# Altium schematic sheet EasyGate1541-II.SchDoc: EasyGate1541-II
size 420 x 297 mm; ApprovedBy: .; CheckedBy: .; Author: DiWou; CompanyName: DL2DW; DrawnBy: DiWou; Engineer: DiWou; Organization: DL2DW; DocumentNumber: 1; Revision: -; SheetNumber: 1; SheetTotal: 1; DrawnDate: 25.01.2021; EngrDate: 25.01.2021; ChkdDate: .; Title1: EasyGate1541-II; Title2: GateArray replacement for Commodore; Title3: 1541-II Disk Drive; Desc1: Version 1.0; Desc2: .; ApprDate: .
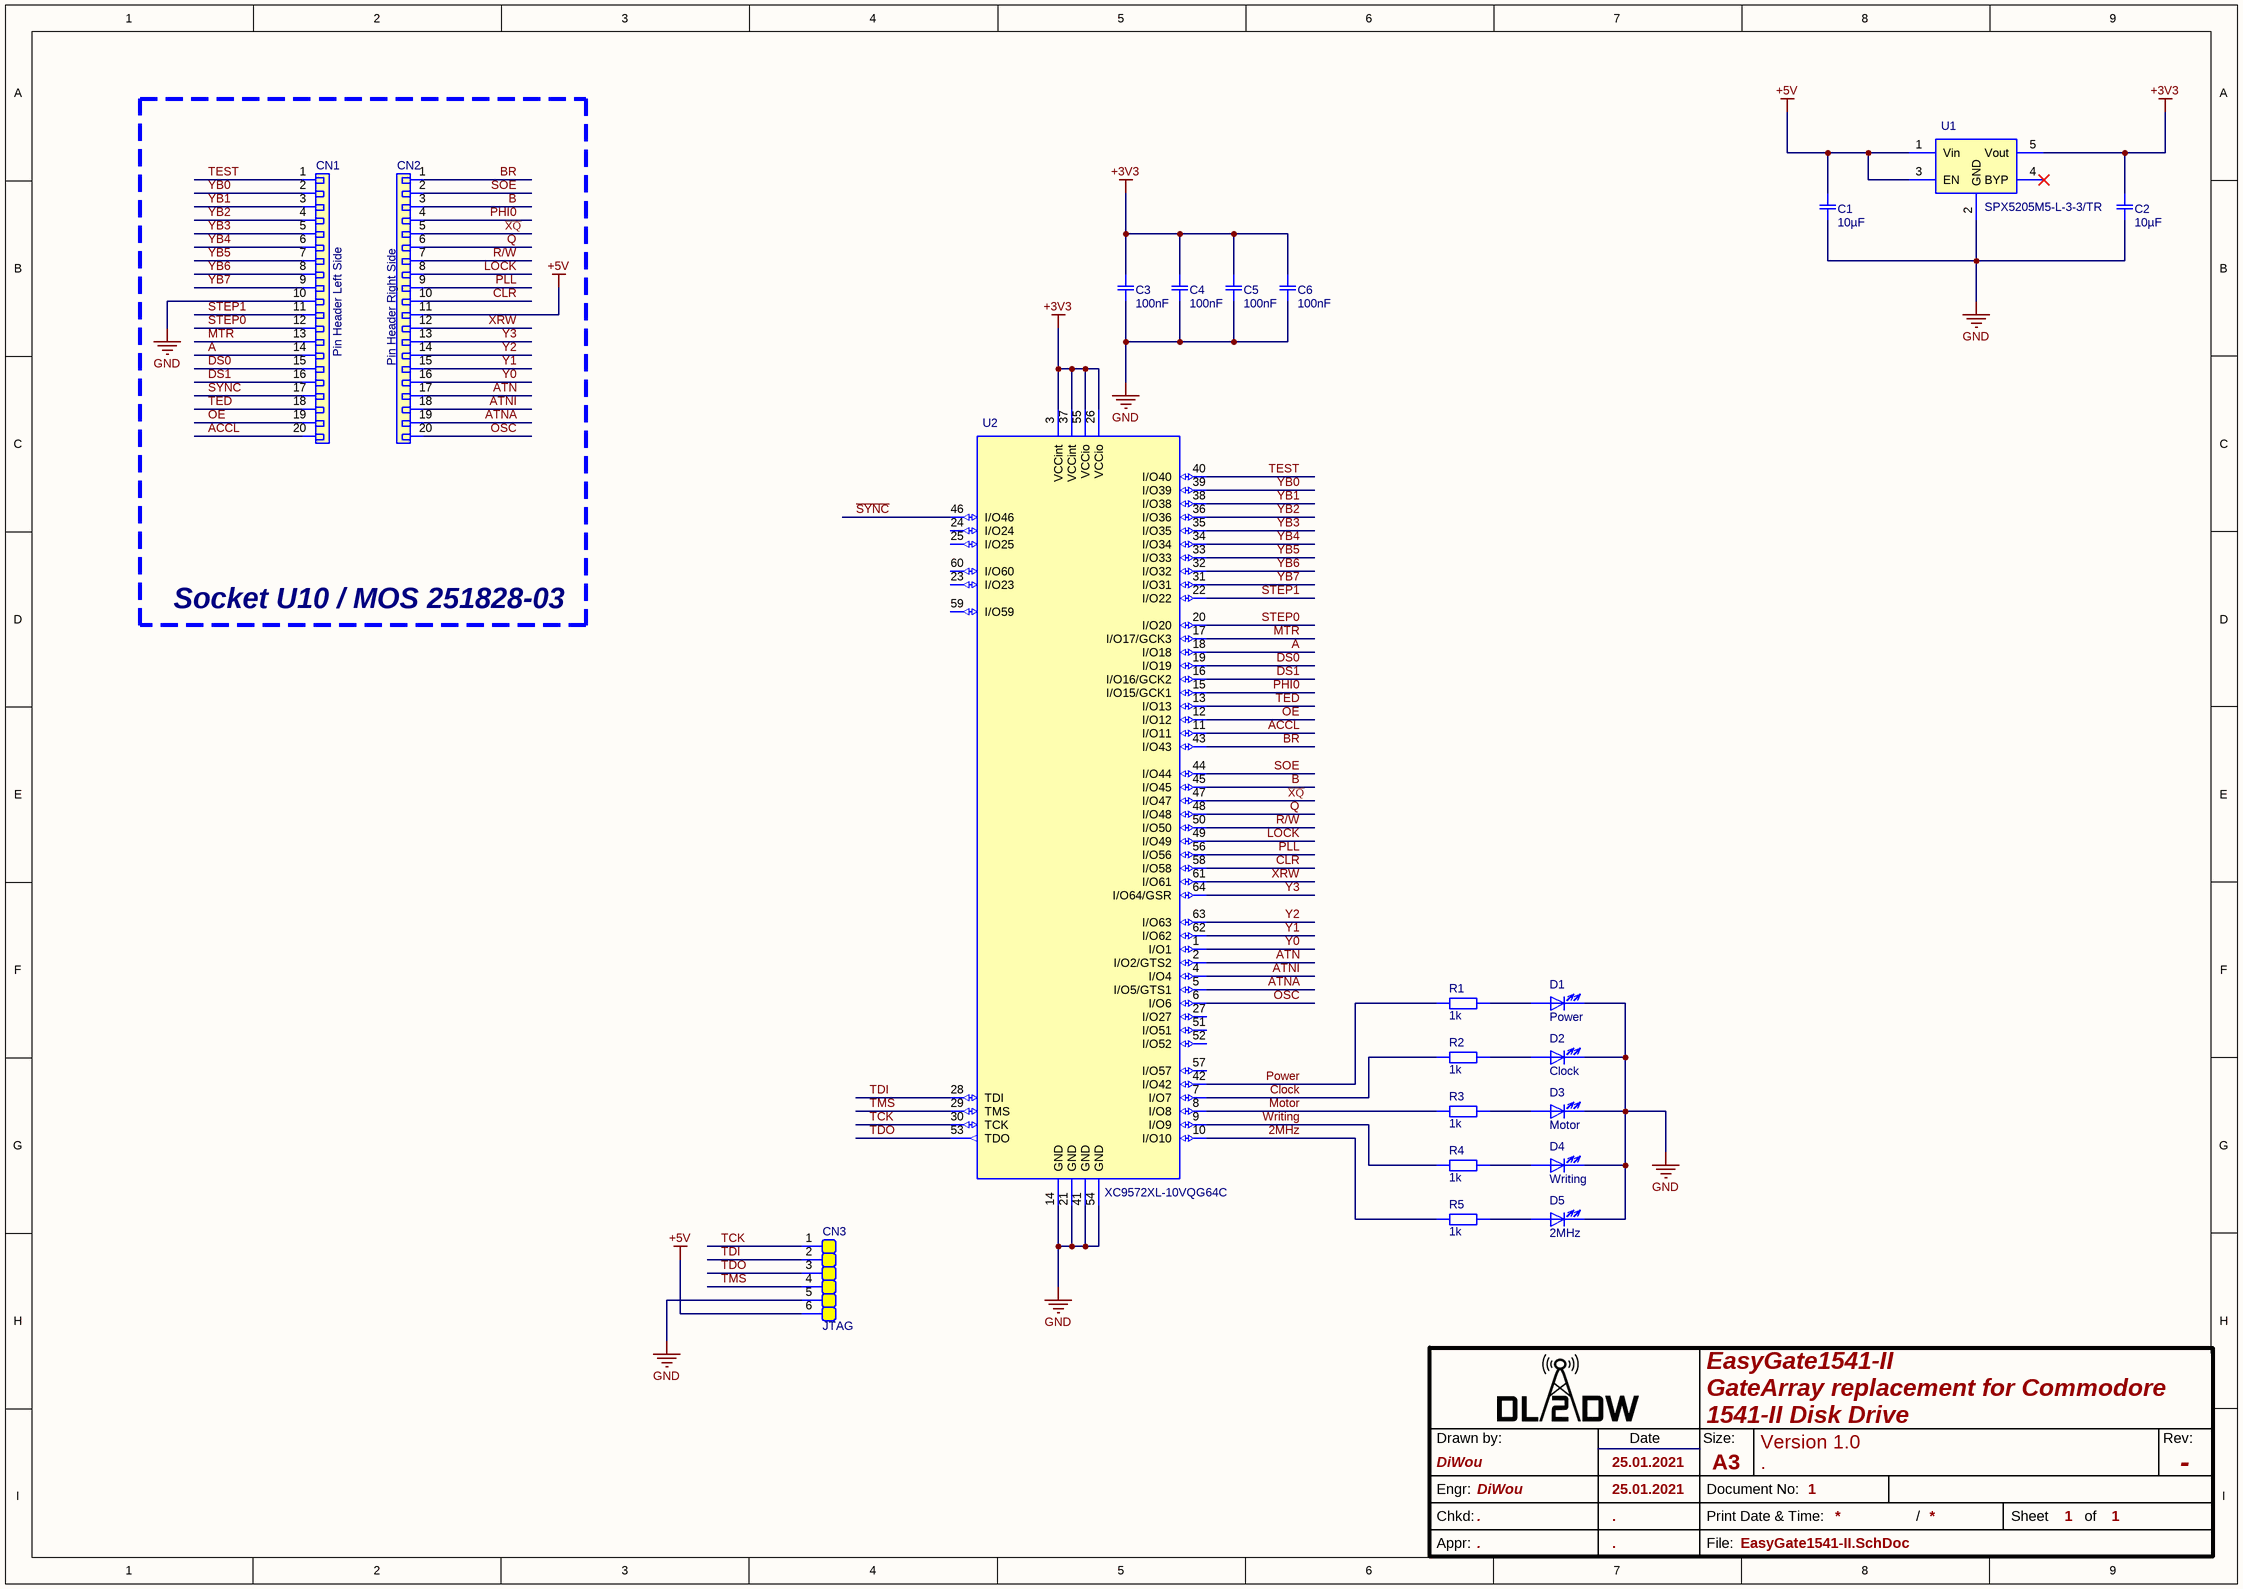
[diagram p0: EasyGate1541-II.SchDoc]

## Parts
C1  10µF  [Kemet C0805CxxxK8RACTU Series H=1.4mm]
C2  10µF  [Kemet C0805CxxxK8RACTU Series H=1.4mm]
C3  100nF  [CAP 100nF SMD 0603 C0603C104J3RACTU]
C4  100nF  [CAP 100nF SMD 0603 C0603C104J3RACTU]
C5  100nF  [CAP 100nF SMD 0603 C0603C104J3RACTU]
C6  100nF  [CAP 100nF SMD 0603 C0603C104J3RACTU]
CN1  Pin Header Left Side  [Pin Header 01x20 2.54mm precision Horizontal Male]
CN2  Pin Header Right Side  [Pin Header 01x20 2.54mm precision Horizontal Male]
CN3  JTAG  [SMD PAD CONN 01x06 small]  (no BOM)
D1  Power  [LED green Gullwing Everlight 25-21/GHC-YSU/2A]
D2  Clock  [LED blue Gullwing Everlight 25-21/BHC-XR2S1/2A]
D3  Motor  [LED white Gullwing Everlight 25-21/T1D-ANQHY/2A]
D4  Writing  [LED red Gullwing Everlight 25-21SURC/S530-A4/TR8]
D5  2MHz  [LED white Gullwing Everlight 25-21/T1D-ANQHY/2A]
R1  1k  [1k Ohm R 0603 SMD]
R2  1k  [1k Ohm R 0603 SMD]
R3  1k  [1k Ohm R 0603 SMD]
R4  1k  [1k Ohm R 0603 SMD]
R5  1k  [1k Ohm R 0603 SMD]
U1  SPX5205M5-L-3-3/TR  [SOT-23-5]
U2  XC9572XL-10VQG64C  [XC9572XL-10VQG64]

## Blocks framed on the sheet
Socket U10 / MOS 251828-03: CN1 CN2

## Nets
+3V3: C2.2 C3.2 C4.2 C5.2 C6.2 U1.5(Vout) U2.3(VCCint) U2.26(VCCio) U2.37(VCCint) U2.55(VCCio)
+5V: C1.2 CN2.11 CN3.6 U1.1(Vin) U1.3(EN)
GND: C1.1 C2.1 C3.1 C4.1 C5.1 C6.1 CN1.10 CN3.5 D1.1 D2.1 D3.1 D4.1 D5.1 U1.2(GND) U2.14(GND) U2.21(GND) U2.41(GND) U2.54(GND)
2MHz: R5.1 U2.10(I/O10)
~{A}: CN1.14 U2.18(I/O18)
~{ACCL}: CN1.20 U2.11(I/O11)
ATN: CN2.17 U2.2(I/O2/GTS2)
ATNA: CN2.19 U2.5(I/O5/GTS1)
ATNI: CN2.18 U2.4(I/O4)
B: CN2.3 U2.45(I/O45)
BR: CN2.1 U2.43(I/O43)
Clock: R2.1 U2.7(I/O7)
CLR: CN2.10 U2.58(I/O58)
DS0: CN1.15 U2.19(I/O19)
DS1: CN1.16 U2.16(I/O16/GCK2)
LOCK: CN2.8 U2.49(I/O49)
Motor: R3.1 U2.8(I/O8)
MTR: CN1.13 U2.17(I/O17/GCK3)
OE: CN1.19 U2.12(I/O12)
OSC: CN2.20 U2.6(I/O6)
PHI0: CN2.4 U2.15(I/O15/GCK1)
PLL: CN2.9 U2.56(I/O56)
Power: R1.1 U2.42(I/O42)
Q: CN2.6 U2.48(I/O48)
R/~{W}: CN2.7 U2.50(I/O50)
~{SYNC}: CN1.17 U2.46(I/O46)
SOE: CN2.2 U2.44(I/O44)
STEP0: CN1.12 U2.20(I/O20)
STEP1: CN1.11 U2.22(I/O22)
TCK: CN3.1 U2.30(TCK)
TDI: CN3.2 U2.28(TDI)
TDO: CN3.3 U2.53(TDO)
TED: CN1.18 U2.13(I/O13)
TEST: CN1.1 U2.40(I/O40)
TMS: CN3.4 U2.29(TMS)
Writing: R4.1 U2.9(I/O9)
~{XQ}: CN2.5 U2.47(I/O47)
~{XRW}: CN2.12 U2.61(I/O61)
Y0: CN2.16 U2.1(I/O1)
Y1: CN2.15 U2.62(I/O62)
Y2: CN2.14 U2.63(I/O63)
Y3: CN2.13 U2.64(I/O64/GSR)
YB0: CN1.2 U2.39(I/O39)
YB1: CN1.3 U2.38(I/O38)
YB2: CN1.4 U2.36(I/O36)
YB3: CN1.5 U2.35(I/O35)
YB4: CN1.6 U2.34(I/O34)
YB5: CN1.7 U2.33(I/O33)
YB6: CN1.8 U2.32(I/O32)
YB7: CN1.9 U2.31(I/O31)
NetD1_2: D1.2 R1.2
NetD2_2: D2.2 R2.2
NetD3_2: D3.2 R3.2
NetD4_2: D4.2 R4.2
NetD5_2: D5.2 R5.2

Not connected (* = marked no-connect by the designer): U1 4(BYP)*; U2 23(I/O23) 24(I/O24) 25(I/O25) 27(I/O27) 51(I/O51) 52(I/O52) 57(I/O57) 59(I/O59) 60(I/O60)

## Notes on the sheet
- Drawn by:
- Date
- Size:
- A3
- Rev:
- Engr:
- Chkd:
- Appr:
- File:
- Document No:
- Print Date & Time:
- /
- Sheet
- of

## Library data of the parts
C1 C2 = CMP-Capacitors-Ceramic_Capacitors-00016-2: KEMET - C0805C106K8RACTU - CAP, 10µF, 10V, 10%, X7R, 0805; Dissipation Factor: 7.5%; Capacitance: 10uF; Max Operating Temperature: 125°C; Packaging: Tape and Reel; Case Code (Imperial): 0805; Depth: 1.25mm; Dielectric Material: Ceramic; Voltage: 10V; Voltage Rating (DC): 10V; Mount: Surface Mount,PCB; Min Operating Temperature: -55°C; Case Code (Metric): 2012; Case/Package: 0805; Thickness: 0.055inch; Termination: SMD/SMT; Voltage Rating: 10V; Height: 1.25mm; Dielectric: X7R; Width: 1.2mm; Package Quantity: 1; Length: 2mm; REACH SVHC: No SVHC; Tolerance: 10%
C3-C6 = CMP-Capacitors-Ceramic_Capacitors-00012-1: KEMET         C0603C104J3RACTU             SMD Multilayer Ceramic Capacitor, 0603 [1608 Metric], 0.1 F, 25 V,  5%, X7R, C Series; Voltage Rating (DC): 25V; Height: 0.8mm; Dielectric: X7R; Case Code (Metric): 1608; Width: 0.031inch; Depth: 0.8mm; Min Operating Temperature: -55°C; Number of Pins: 2; Mount: Surface Mount,PCB; REACH SVHC: No SVHC; Packaging: Tape and Reel; Case Code (Imperial): 0603; Contact Plating: Tin,Matte; Length: 1.6mm; Case/Package: 0603; Lead Pitch: 0.7mm; Package Quantity: 4000; Tolerance: 5%; Radiation Hardening: No; Dielectric Material: Ceramic; Voltage: 25V; Termination: SMD/SMT; Capacitance: 100nF; Voltage Rating: 25V; Thickness: 0.034inch; Max Operating Temperature: 125°C
CN1 CN2 = CMP-Connectors-Male_PIN_Headers-00031-2: Conn Header Vert 20POS 2MM; Connector Type: Male Pin; Pitch: 0.079inch; Number of Positions: 20; Contact Plating: Gold; Termination: Solder; Contact Mating Length: 0.141inch; Color: Black; Number of Rows: 1; Package Quantity: 250; Mount: Through Hole; Packaging: Bulk
CN3 = CMP-Connectors-00022-1: SMD Pad Connector 01x06
D1 = CMP-LEDs-00010-1: LED Uni-Color Green 518nm 2-Pin Chip LED T/R; Number of LEDs: 1; Forward Current: 20mA; Lens Style: Diffused,Colorless,Circular; Forward Voltage: 3.5V; Dominant Wavelength: 525nm; Viewing Angle: 60°; Color: Green; Number of Pins: 2; Radiation Hardening: No; Mount: Surface Mount; Packaging: Tape and Reel
D2 = CMP-LEDs-00012-1: LED Uni-Color Blue 468nm Chip LED 2-Pin SMD T/R; Forward Current: 20mA
D3 D5 = CMP-LEDs-00011-1: Standard LEDs - SMD SMD LED; Reverse Voltage: 5V; Test Current: 5mA; Lens Color: Yellow; Viewing Angle: 130°; Forward Current: 25mA; Color: White; Number of LEDs: 1; Lens Transparency: Diffused; Forward Voltage: 2.92V; Luminous Intensity: 70mcd; Lens Style: Diffused,Colored,Circular; Power Dissipation: 95mW; Mount: Surface Mount; Radiation Hardening: No; Case/Package: SMD/SMT; Max Operating Temperature: 85°C; Number of Pins: 2; Width: 1.6mm; Length: 3.2mm; Depth: 1.6mm; Packaging: Tape and Reel; Min Operating Temperature: -40°C; Package Quantity: 2000; Height: 1.1mm; Number of Elements: 1
D4 = CMP-LEDs-00009-3: SMD LED red 2.7. . .3.15 V Bottom View, 25-21SURC/S530-A4/TR8, Everlight Electronics; Forward Current: 20mA
R1-R5 = CMP-Resistors-Yageo_SMD_060300002-1: RES SMD 1K OHM 1% 1/10W 0603; Power Rating: 100mW; Resistance: 1kR; Voltage Rating: 50V; Temperature Coefficient: 100ppm/°C; Case/Package: 0603; REACH SVHC: No SVHC; Length: 1.6mm; Tolerance: 1%; Case Code (Metric): 1608; Contact Plating: Tin,Matte; Height: 0.45mm; Case Code (Imperial): 0603; Packaging: Tape and Reel; Max Operating Temperature: 155°C; Military Standard: Not; Lead Free: Lead Free; Depth: 0.8mm; Termination: SMD/SMT; Min Operating Temperature: -55°C; Composition: Thick Film; Radiation Hardening: No
U1 = CMP-ICs-Power_Supply-00002-2: LDO Regulator Pos 3.3V 0.15A 5-Pin SOT-23 T/R; Min Input Voltage: 2.5V; Number of Outputs: 1; Dropout Voltage: 210mV; Accuracy: 1%; Polarity: Positive; Max Input Voltage: 16V; Output Type: Fixed; Output Current: 150mA; Quiescent Current: 1uA; Packaging: Tape and Reel; Lead Free: Lead Free; Case/Package: SOT-23; Height: 1.15mm; Number of Regulators: 1; Max Operating Temperature: 125°C; Min Operating Temperature: -40°C; Output Voltage: 3.3V; Width: 1.6mm; Radiation Hardening: No; Mount: Surface Mount; Length: 2.9mm; Max Output Current: 150mA; Min Output Voltage: 3.3V; Number of Pins: 5
U2 = CMP-ICs-CPLD_FPGA-00004-1: IC CPLD 72MC 10NS 64VQFP; Speed Grade: 10; Number of Logic Blocks (LABs): 4; Number of I/Os: 52; Min Supply Voltage: 3V; Max Frequency: 100MHz; Memory Type: FLASH; Number of Macrocells: 72; Operating Supply Voltage: 3.3V; Max Supply Voltage: 3.6V; Number of Gates: 1600; Min Operating Temperature: 0°C; Radiation Hardening: No; Package Quantity: 160; Contact Plating: Tin,Matte; Max Operating Temperature: 70°C; Case/Package: TQFP; Mount: Surface Mount; Propagation Delay: 10ns; Turn-On Delay Time: 10ns; Number of Pins: 64; Lead Free: Lead Free; Number of Logic Elements/Cells: 4; Packaging: Tray